# EAGLE design untitled (EAGLE 6.5.0)
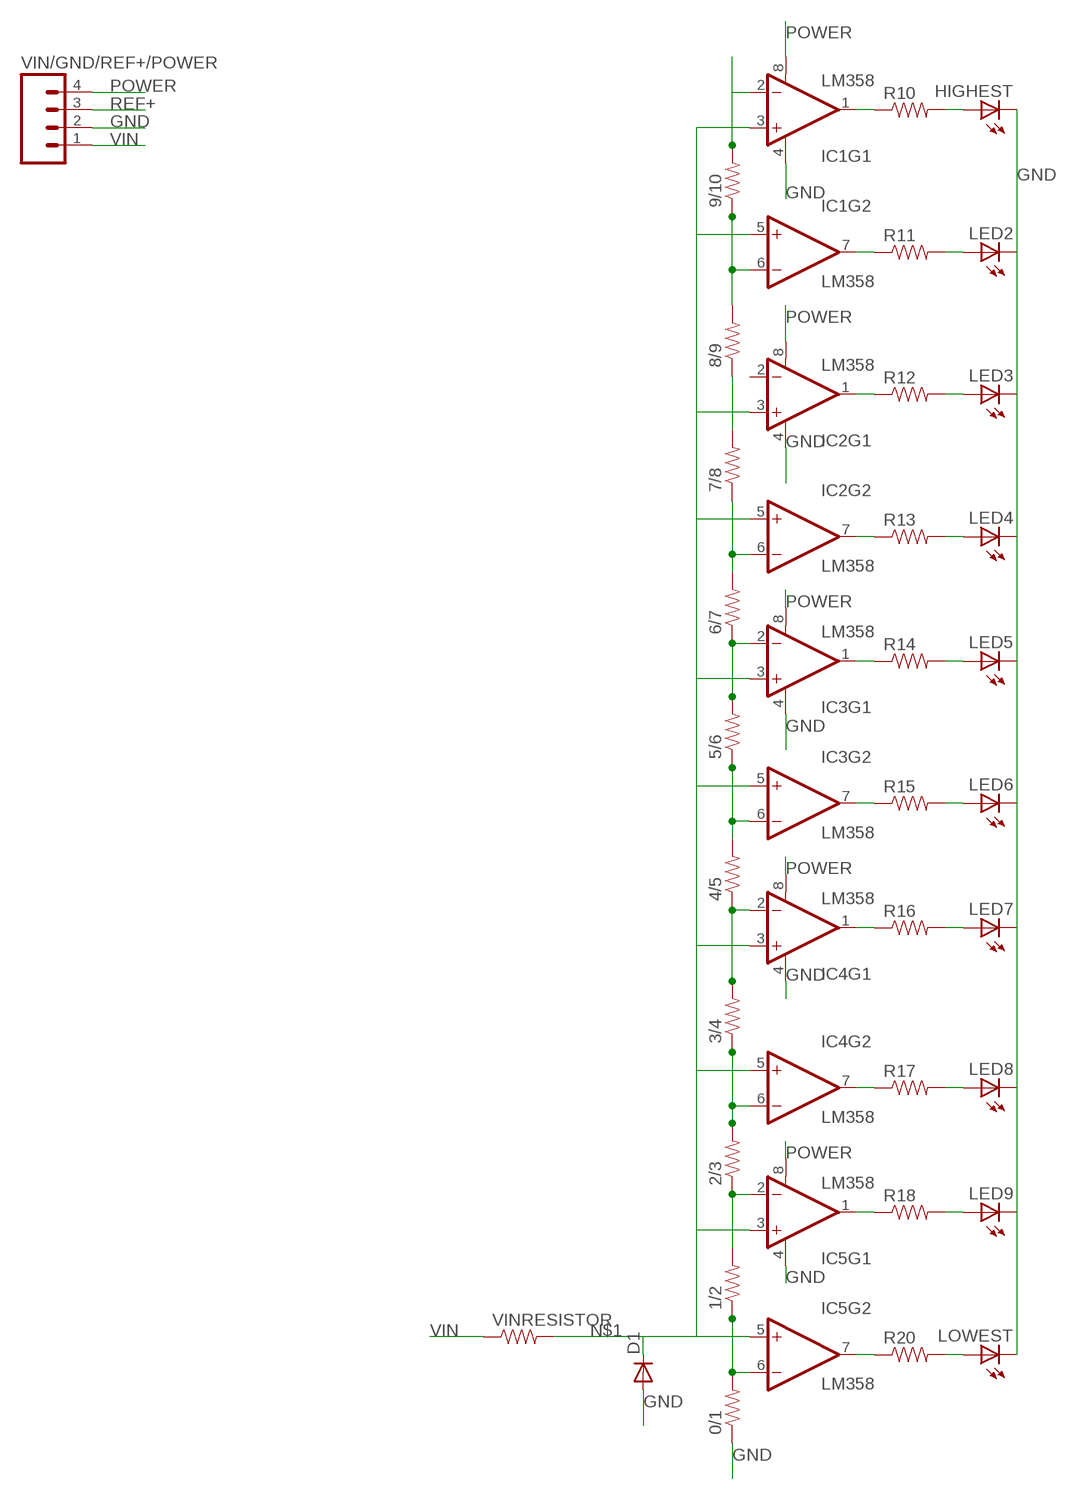
[diagram p0: schematic, sheet 1]

## Parts
0/1  RESISTORPTH-1/4W  [AXIAL-0.4]
1/2  RESISTORPTH-1/4W  [AXIAL-0.4]
2/3  RESISTORPTH-1/4W  [AXIAL-0.4]
3/4  RESISTORPTH-1/4W  [AXIAL-0.4]
4/5  RESISTORPTH-1/4W  [AXIAL-0.4]
5/6  RESISTORPTH-1/4W  [AXIAL-0.4]
6/7  RESISTORPTH-1/4W  [AXIAL-0.4]
7/8  RESISTORPTH-1/4W  [AXIAL-0.4]
8/9  RESISTORPTH-1/4W  [AXIAL-0.4]
9/10  RESISTORPTH-1/4W  [AXIAL-0.4]
D1  DIODE1N4148  [DIODE-1N4148]
HIGHEST  LED5MM  [LED5MM]
IC1  LM358  [DIP08]
IC2  LM358  [DIP08]
IC3  LM358  [DIP08]
IC4  LM358  [DIP08]
IC5  LM358  [DIP08]
LED2  LED5MM  [LED5MM]
LED3  LED5MM  [LED5MM]
LED4  LED5MM  [LED5MM]
LED5  LED5MM  [LED5MM]
LED6  LED5MM  [LED5MM]
LED7  LED5MM  [LED5MM]
LED8  LED5MM  [LED5MM]
LED9  LED5MM  [LED5MM]
LOWEST  LED5MM  [LED5MM]
R10  RESISTORPTH-1/4W  [AXIAL-0.4]
R11  RESISTORPTH-1/4W  [AXIAL-0.4]
R12  RESISTORPTH-1/4W  [AXIAL-0.4]
R13  RESISTORPTH-1/4W  [AXIAL-0.4]
R14  RESISTORPTH-1/4W  [AXIAL-0.4]
R15  RESISTORPTH-1/4W  [AXIAL-0.4]
R16  RESISTORPTH-1/4W  [AXIAL-0.4]
R17  RESISTORPTH-1/4W  [AXIAL-0.4]
R18  RESISTORPTH-1/4W  [AXIAL-0.4]
R20  RESISTORPTH-1/4W  [AXIAL-0.4]
VIN/GND/REF+/POWER  M04PTH  [1X04]
VINRESISTOR  RESISTORPTH-1/4W  [AXIAL-0.4]

## Nets
GND: 0/1.P$1 D1.A HIGHEST.K(C) IC1.4(V-) IC2.4(V-) IC3.4(V-) IC4.4(V-) IC5.4(V-) LED2.K(C) LED3.K(C) LED4.K(C) LED5.K(C) LED6.K(C) LED7.K(C) LED8.K(C) LED9.K(C) LOWEST.K(C) VIN/GND/REF+/POWER.2
N$1: D1.C IC1.3(+IN) IC1.5(+IN) IC2.3(+IN) IC2.5(+IN) IC3.3(+IN) IC3.5(+IN) IC4.3(+IN) IC4.5(+IN) IC5.3(+IN) IC5.5(+IN) VINRESISTOR.P$2
N$2: 8/9.P$2 9/10.P$1 IC1.6(-IN)
N$4: 7/8.P$2 8/9.P$1
N$5: 6/7.P$2 7/8.P$1 IC2.6(-IN)
N$6: 5/6.P$2 6/7.P$1 IC3.2(-IN)
N$7: 4/5.P$2 5/6.P$1 IC3.6(-IN)
N$8: 3/4.P$2 4/5.P$1 IC4.2(-IN)
N$9: 2/3.P$2 3/4.P$1 IC4.6(-IN)
N$10: 1/2.P$2 2/3.P$1 IC5.2(-IN)
N$11: 0/1.P$2 1/2.P$1 IC5.6(-IN)
N$24: IC5.7(OUT) R20.P$1
N$25: IC5.1(OUT) R18.P$1
N$26: IC4.7(OUT) R17.P$1
N$27: IC4.1(OUT) R16.P$1
N$28: IC3.7(OUT) R15.P$1
N$29: IC3.1(OUT) R14.P$1
N$30: IC2.7(OUT) R13.P$1
N$31: IC2.1(OUT) R12.P$1
N$32: IC1.7(OUT) R11.P$1
N$33: IC1.1(OUT) R10.P$1
N$34: HIGHEST.A R10.P$2
N$35: LED2.A R11.P$2
N$36: LED3.A R12.P$2
N$37: LED4.A R13.P$2
N$38: LED5.A R14.P$2
N$39: LED6.A R15.P$2
N$40: LED7.A R16.P$2
N$41: LED8.A R17.P$2
N$42: LED9.A R18.P$2
N$43: LOWEST.A R20.P$2
POWER: IC1.8(V+) IC2.8(V+) IC3.8(V+) IC4.8(V+) IC5.8(V+) VIN/GND/REF+/POWER.4
REF+: 9/10.P$2 IC1.2(-IN) VIN/GND/REF+/POWER.3
VIN: VIN/GND/REF+/POWER.1 VINRESISTOR.P$1
Unconnected: IC2.2(-IN)

## Library data of the parts
0/1 1/2 2/3 3/4 4/5 5/6 6/7 7/8 8/9 9/10 R10-R18 R20 VINRESISTOR = SparkFun-Resistors:RESISTOR: Resistor Basic schematic elements and footprints for 0603, 1206, and PTH resistors.
D1 = SparkFun-DiscreteSemi:DIODE: Diode These are standard reverse protection diodes and small signal diodes. SMA package can handle up to about 1A. SOD-323 can handle about 200mA. What the SOD-323 package when ordering, there are some mfgs out there that are 5-pin packages.
HIGHEST LED2-LED9 LOWEST = SparkFun-LED:LED: LEDs Standard schematic elements and footprints for 5mm, 3mm, 1206, and 0603 sized LEDs. 5mm - Spark Fun Electronics SKU : COM-00529 (and others)
IC1-IC5 = SparkFun-AnalogIC:LM358: Jellybean op-amp; PROD_ID: IC-09172
VIN/GND/REF+/POWER = SparkFun-Connectors:M04: Header 4 Standard 4-pin 0.1" header. Use with straight break away headers (SKU : PRT-00116), right angle break away headers (PRT-00553), swiss pins (PRT-00743), machine pins (PRT-00117), and female headers (PRT-00115). Molex polarized connector foot print use with SKU : PRT-08231 with associated crimp pins and housings. 1MM SMD Version SKU: PRT-10208

## Board
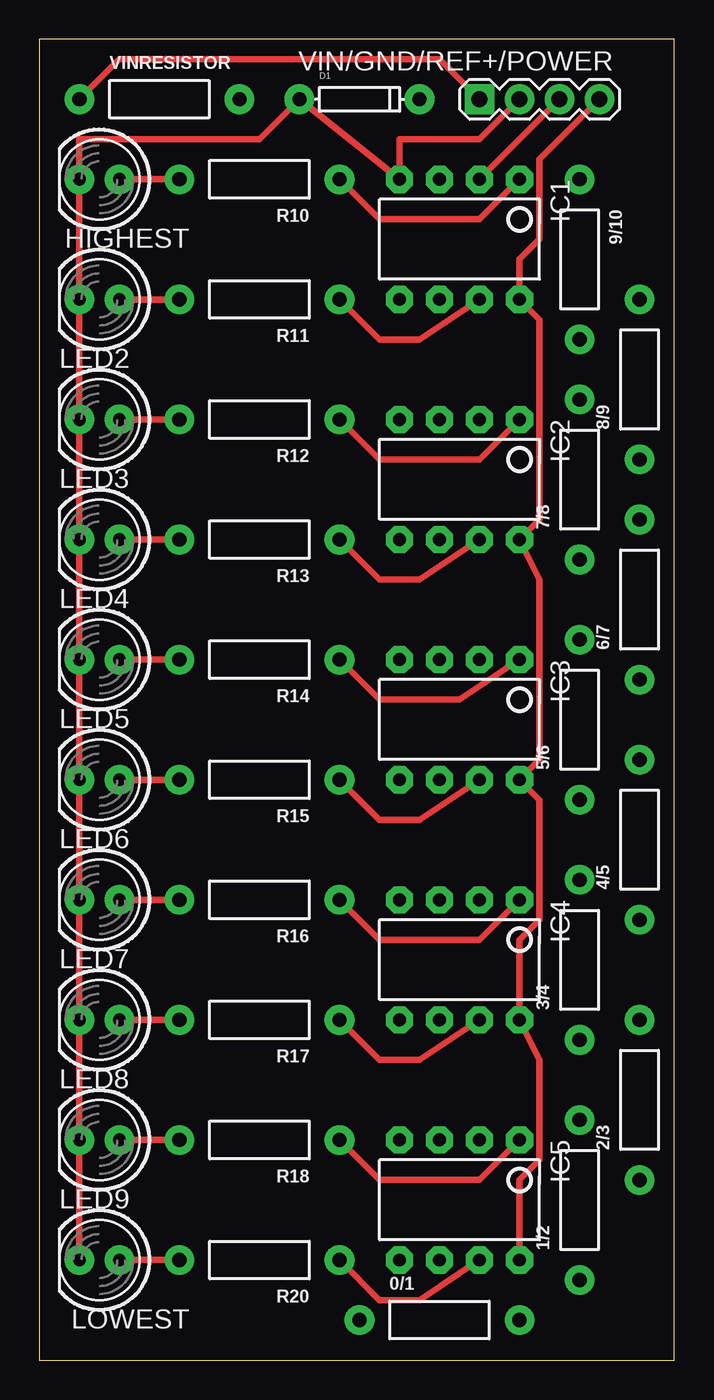
[diagram p1: board, top side]
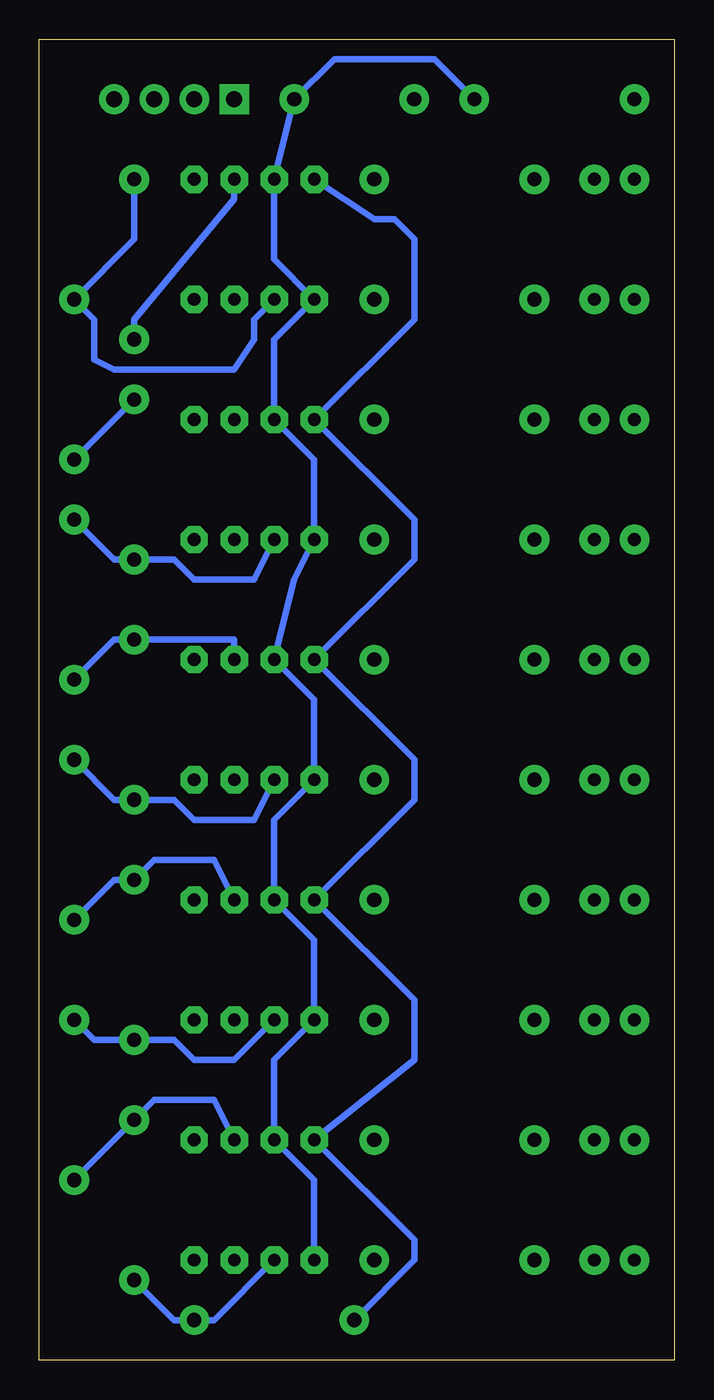
[diagram p2: board, bottom side, seen from below]

Size 40.31 x 83.81 mm. Coordinates in mm from the lower left corner, seen from the top.
Outline: 0,0 40.31,0 40.31,83.81 0,83.81 0,0
Copper layers (1*16): Top 0.035mm / dielectric 1.5mm / Bottom 0.035mm
Design rules "default": minimum track width 10mil, minimum drill 24mil, track to track 8mil, track to pad 8mil, pad to pad 8mil, via to via 8mil, smd to smd 8mil, copper to edge 40mil, drill to drill 8mil, minimum pad ring 10mil, minimum via ring 8mil, stop-mask expansion 4mil, vias tented up to drill 0mil, thermal gap 10mil

### Footprints (pad centres in the part's own frame; a part is rotated, then mirrored left to right if it is on the bottom)
AXIAL-0.4 = drill 0.9 pad 1.88: P$1 -5.08,0; P$2 5.08,0
DIODE-1N4148 = drill 0.9 pad 1.88: A -3.81,0; C 3.81,0
LED5MM = drill 0.813 pad 1.88: A -1.27,0; K 1.27,0
DIP08 = drill 0.813 pad 1.727 octagon: 1 -3.81,-3.81; 2 -1.27,-3.81; 3 1.27,-3.81; 4 3.81,-3.81; 5 3.81,3.81; 6 1.27,3.81; 7 -1.27,3.81; 8 -3.81,3.81
1X04 = drill 1.016 pad 1.88 square: 1 0,0 | drill 1.016 pad 1.88: 2 2.54,0; 3 5.08,0; 4 7.62,0

### Placement (x,y rotation side)
0/1  25.4,2.54 0 top
1/2  34.29,10.16 90 top
2/3  38.1,16.51 90 top
3/4  34.29,25.4 90 top
4/5  38.1,33.02 90 top
5/6  34.29,40.64 90 top
6/7  38.1,48.26 90 top
7/8  34.29,55.88 90 top
8/9  38.1,62.23 90 top
9/10  34.29,69.85 270 top
D1  20.32,80.01 0 top
HIGHEST  3.81,74.93 180 top
IC1  26.67,71.12 180 top
IC2  26.67,55.88 180 top
IC3  26.67,40.64 180 top
IC4  26.67,25.4 180 top
IC5  26.67,10.16 180 top
LED2  3.81,67.31 180 top
LED3  3.81,59.69 180 top
LED4  3.81,52.07 180 top
LED5  3.81,44.45 180 top
LED6  3.81,36.83 180 top
LED7  3.81,29.21 180 top
LED8  3.81,21.59 180 top
LED9  3.81,13.97 180 top
LOWEST  3.81,6.35 180 top
R10  13.97,74.93 180 top
R11  13.97,67.31 180 top
R12  13.97,59.69 180 top
R13  13.97,52.07 180 top
R14  13.97,44.45 180 top
R15  13.97,36.83 180 top
R16  13.97,29.21 180 top
R17  13.97,21.59 180 top
R18  13.97,13.97 180 top
R20  13.97,6.35 180 top
VIN/GND/REF+/POWER  27.94,80.01 0 top
VINRESISTOR  7.62,80.01 0 top

### Tracks (layer width: path | path; a pad name or v marks a point on that pad's centre or on a via)
GND
  Top 0.406: LOWEST.K LED9.K LED8.K LED7.K LED6.K LED5.K LED4.K LED3.K LED2.K HIGHEST.K 2.54,77.47 13.97,77.47 D1.A IC1.4 22.86,77.47 27.94,77.47 VIN/GND/REF+/POWER.2
  Bottom 0.406: IC1.4 19.05,72.39 17.78,72.39 16.51,71.12 16.51,66.04 IC2.4 16.51,53.34 16.51,50.8 IC3.4 16.51,38.1 16.51,35.56 IC4.4 16.51,22.86 16.51,19.05 IC5.4 16.51,7.62 16.51,6.35 0/1.P$1
N$1
  Bottom 0.406: VINRESISTOR.P$2 15.24,82.55 21.59,82.55 D1.C IC1.3 25.4,69.85 IC1.5 25.4,64.77 IC2.3 22.86,57.15 IC2.5 24.13,49.53 IC3.3 22.86,41.91 IC3.5 25.4,34.29 IC4.3 22.86,26.67 IC4.5 25.4,19.05 IC5.3 22.86,11.43 IC5.5
N$2
  Bottom 0.406: 9/10.P$1 34.29,71.12 8/9.P$2 36.83,66.04 36.83,63.5 35.56,62.87 27.94,62.87 26.67,64.77 26.67,66.04 IC1.6
N$4
  Bottom 0.406: 7/8.P$2 8/9.P$1
N$5
  Bottom 0.406: 6/7.P$2 35.56,50.8 7/8.P$1 31.75,50.8 30.48,49.53 26.67,49.53 IC2.6
N$6
  Bottom 0.406: 6/7.P$1 35.56,45.72 5/6.P$2 27.94,45.72 IC3.2
N$7
  Bottom 0.406: 4/5.P$2 35.56,35.56 5/6.P$1 31.75,35.56 30.48,34.29 26.67,34.29 IC3.6
N$8
  Bottom 0.406: 4/5.P$1 35.56,30.48 3/4.P$2 33.02,31.75 29.21,31.75 IC4.2
N$9
  Bottom 0.406: 2/3.P$2 36.83,20.32 3/4.P$1 31.75,20.32 30.48,19.05 27.94,19.05 IC4.6
N$10
  Bottom 0.406: 2/3.P$1 1/2.P$2 33.02,16.51 29.21,16.51 IC5.2
N$11
  Bottom 0.406: 1/2.P$1 31.75,2.54 0/1.P$2 29.21,2.54 IC5.6
N$24
  Top 0.406: R20.P$1 21.59,3.81 24.13,3.81 IC5.7
N$25
  Top 0.406: R18.P$1 21.59,11.43 27.94,11.43 IC5.1
N$26
  Top 0.406: R17.P$1 21.59,19.05 24.13,19.05 IC4.7
N$27
  Top 0.406: R16.P$1 21.59,26.67 27.94,26.67 IC4.1
N$28
  Top 0.406: R15.P$1 21.59,34.29 24.13,34.29 IC3.7
N$29
  Top 0.406: R14.P$1 21.59,41.91 26.67,41.91 IC3.1
N$30
  Top 0.406: R13.P$1 21.59,49.53 24.13,49.53 IC2.7
N$31
  Top 0.406: R12.P$1 21.59,57.15 27.94,57.15 IC2.1
N$32
  Top 0.406: R11.P$1 21.59,64.77 24.13,64.77 IC1.7
N$33
  Top 0.406: R10.P$1 21.59,72.39 27.94,72.39 IC1.1
N$34
  Top 0.406: HIGHEST.A R10.P$2
N$35
  Top 0.406: LED2.A R11.P$2
N$36
  Top 0.406: LED3.A R12.P$2
N$37
  Top 0.406: LED4.A R13.P$2
N$38
  Top 0.406: LED5.A R14.P$2
N$39
  Top 0.406: LED6.A R15.P$2
N$40
  Top 0.406: LED7.A R16.P$2
N$41
  Top 0.406: LED8.A R17.P$2
N$42
  Top 0.406: LED9.A R18.P$2
N$43
  Top 0.406: LOWEST.A R20.P$2
POWER
  Top 0.406: IC5.8 30.48,11.43 31.75,12.7 31.75,19.05 IC4.8 30.48,26.67 31.75,27.94 31.75,35.56 IC3.8 31.75,38.1 31.75,49.53 IC2.8 31.75,53.34 31.75,66.04 IC1.8 30.48,69.85 31.75,71.12 31.75,76.2 VIN/GND/REF+/POWER.4
REF+
  Top 0.406: IC1.2 VIN/GND/REF+/POWER.3
  Bottom 0.406: 9/10.P$2 34.29,66.04 27.94,73.66 IC1.2
VIN
  Top 0.406: VINRESISTOR.P$1 5.08,82.55 25.4,82.55 VIN/GND/REF+/POWER.1